# EAGLE design ESP-Gateway (EAGLE 7.5.0)
CNAME: Wemos D1 Mini NRF24 Gateway; CREVISION: 1.0; DESIGNER: Diving91
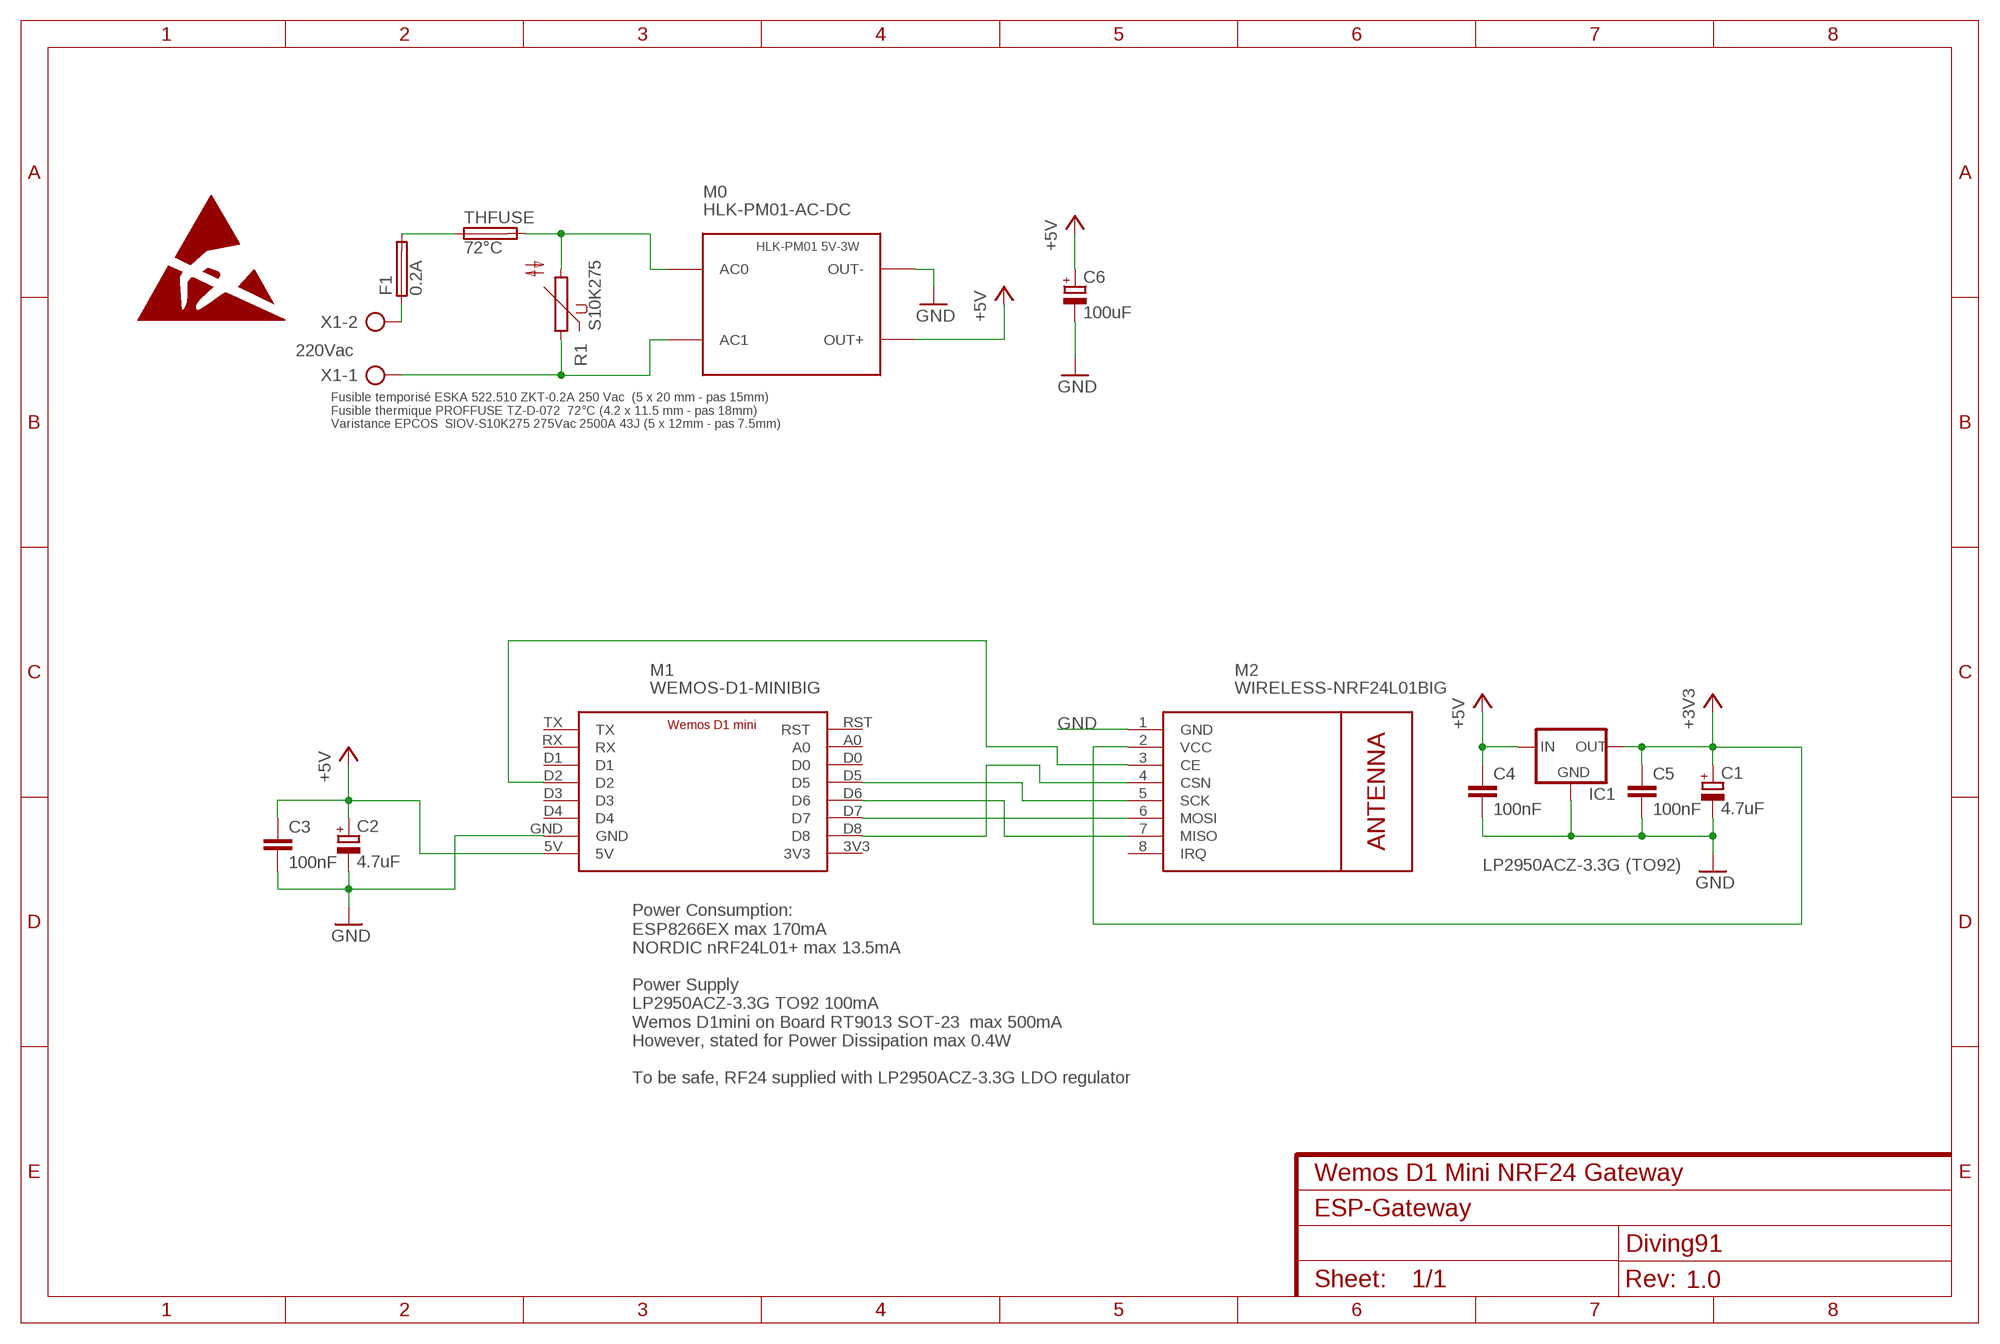
[diagram p0: schematic, sheet 1]

## Parts
C1  4.7uF  CPOL-RAD5X12E2-5  [E2-5@1]
C2  4.7uF  CPOL-RAD5X12E2-5  [E2-5@1]
C3  100nF  C3202.5/4  [C2.5-4]
C4  100nF  C3202.5/4  [C2.5-4]
C5  100nF  C3202.5/4  [C2.5-4]
C6  100uF  CPOL-RADE3-8  [E3-8]
F1  0.2A  PTF75  [PTF75]
IC1  LP2950ACZ-3.3G (TO92)  78LXXTO92L  [DC-DC-TO92L]
M0  HLK-PM01-AC-DC  [HLK-PM01-AC-DC]
M1  WEMOS-D1-MINIBIG  [WEMOS-D1-MINI-DIY]
M2  WIRELESS-NRF24L01BIG  [WIRELESS-NRF24L01-DIY]
R1  S10K275  [S10K275]
THFUSE  72°C  PROFFUSE-TZ-D  [PROFFUSE-TZ-D]
X1  220Vac  DG301-5.0  [DG301-5.0]

## Nets
+3V3 [VCC]: C1.+ C5.1 IC1.OUT M2.2(VCC)
+5V [VCC]: C2.+ C3.1 C4.1 C6.+ IC1.IN M0.OUT+ M1.5V
CE: M1.D2 M2.3(CE)
CSN: M1.D8 M2.4(CSN)
GND [VCC]: C1.- C2.- C3.2 C4.2 C5.2 C6.- IC1.GND M0.OUT- M1.GND M2.1(GND)
MISO: M1.D6 M2.7(MISO)
MOSI: M1.D7 M2.6(MOSI)
N$0 [AC]: M0.AC1 R1.1 X1.1
N$1 [AC]: F1.2 THFUSE.1
N$3 [AC]: F1.1 X1.2
N$4 [AC]: M0.AC0 R1.2 THFUSE.2
SCK: M1.D5 M2.5(SCK)
Unconnected: M1.A0 M1.D0 M1.D1 M1.D3 M1.D4 M1.RST M1.RX M1.TX M2.8(IRQ)

## Notes on the sheet
- Fusible temporisé ESKA 522.510 ZKT-0.2A 250 Vac  (5 x 20 mm - pas 15mm)
  Fusible thermique PROFFUSE TZ-D-072  72°C (4.2 x 11.5 mm - pas 18mm)
  Varistance EPCOS  SIOV-S10K275 275Vac 2500A 43J (5 x 12mm - pas 7.5mm)
- Power Consumption:
  ESP8266EX max 170mA
  NORDIC nRF24L01+ max 13.5mA
  
  Power Supply
  LP2950ACZ-3.3G TO92 100mA
  Wemos D1mini on Board RT9013 SOT-23  max 500mA
  However, stated for Power Dissipation max 0.4W
  
  To be safe, RF24 supplied with LP2950ACZ-3.3G LDO regulator

## Power pins joined to a net without a drawn wire
3V3: M1.3V3

## Library data of the parts
C1 C2 = diving91:CPOL-RAD5X12: POLARIZED CAPACITOR, European symbol
C3-C5 = diving91:C320: CAPACITOR naming: grid - package width
C6 = diving91:CPOL-RAD: POLARIZED CAPACITOR, European symbol
F1 = diving91:PTF75: FUSE HOLDER grid 15mm Stelvio Kontex PTF75
IC1 = diving91:78LXX: VOLTAGE REGULATOR
M0 = diving91:HLK-PM01-AC-DC: HLK-PM01 AC-DC 110-220VAC to 5V Mini Power Supply Module http://www.hlktech.net/product_detail.php?ProId=54
M1 = diving91:WEMOS-D1-MINI: WEMOS D1 mini http://www.wemos.cc/wiki/doku.php?id=en:d1_mini
M2 = diving91:WIRELESS-NRF24L01: 2.4 GHz Wireless Module based on NRF24L01 chip
R1 = diving91:S10K275: VARISTOR
THFUSE = diving91:PROFFUSE-TZ-D: PROFFUSE TZ-D
X1 = diving91:DG301-5.0: CONNECTOR Degson DG301 5.0mm

## Net classes
0 default: width 0.635 mm, clearance 0.635 mm
1 AC: width 1.93 mm, clearance 1.93 mm
2 VCC: width 1.016 mm, clearance 1.143 mm

## Board
Carte Gateway MySensors ESP8266 - RF24 alimentée en 220V
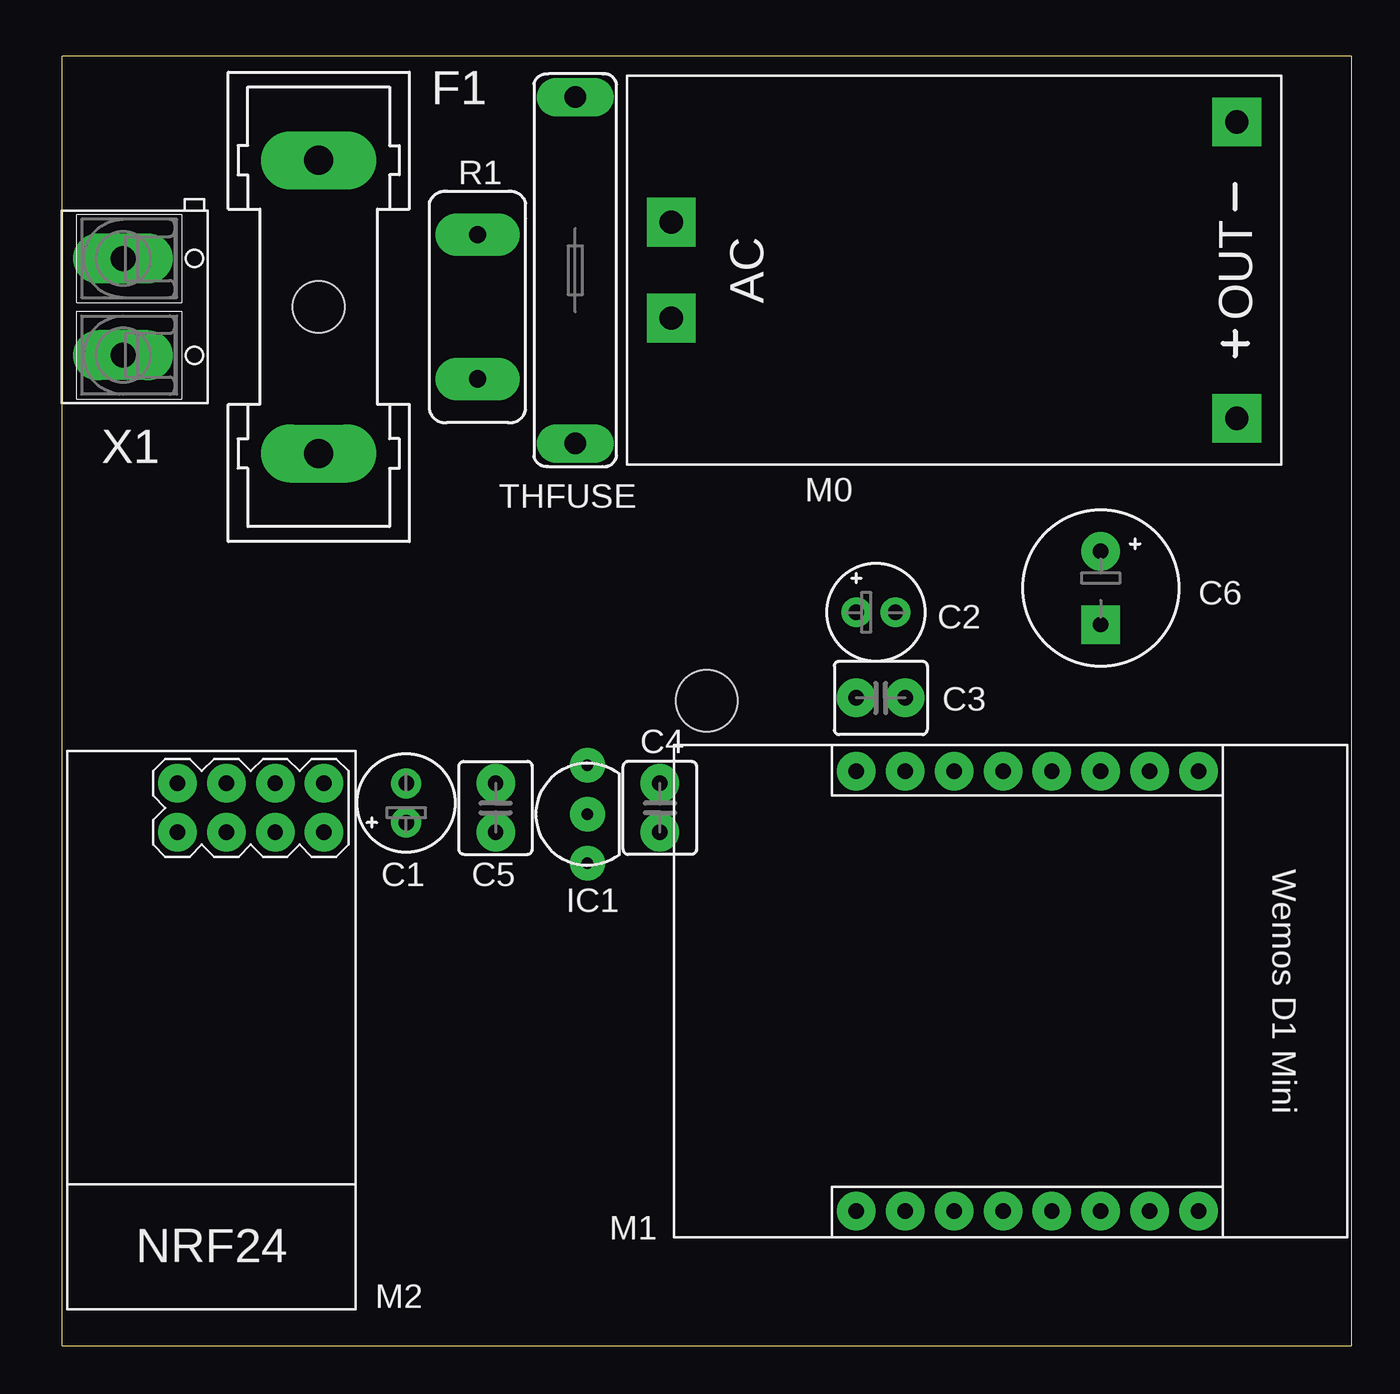
[diagram p1: board, top side]
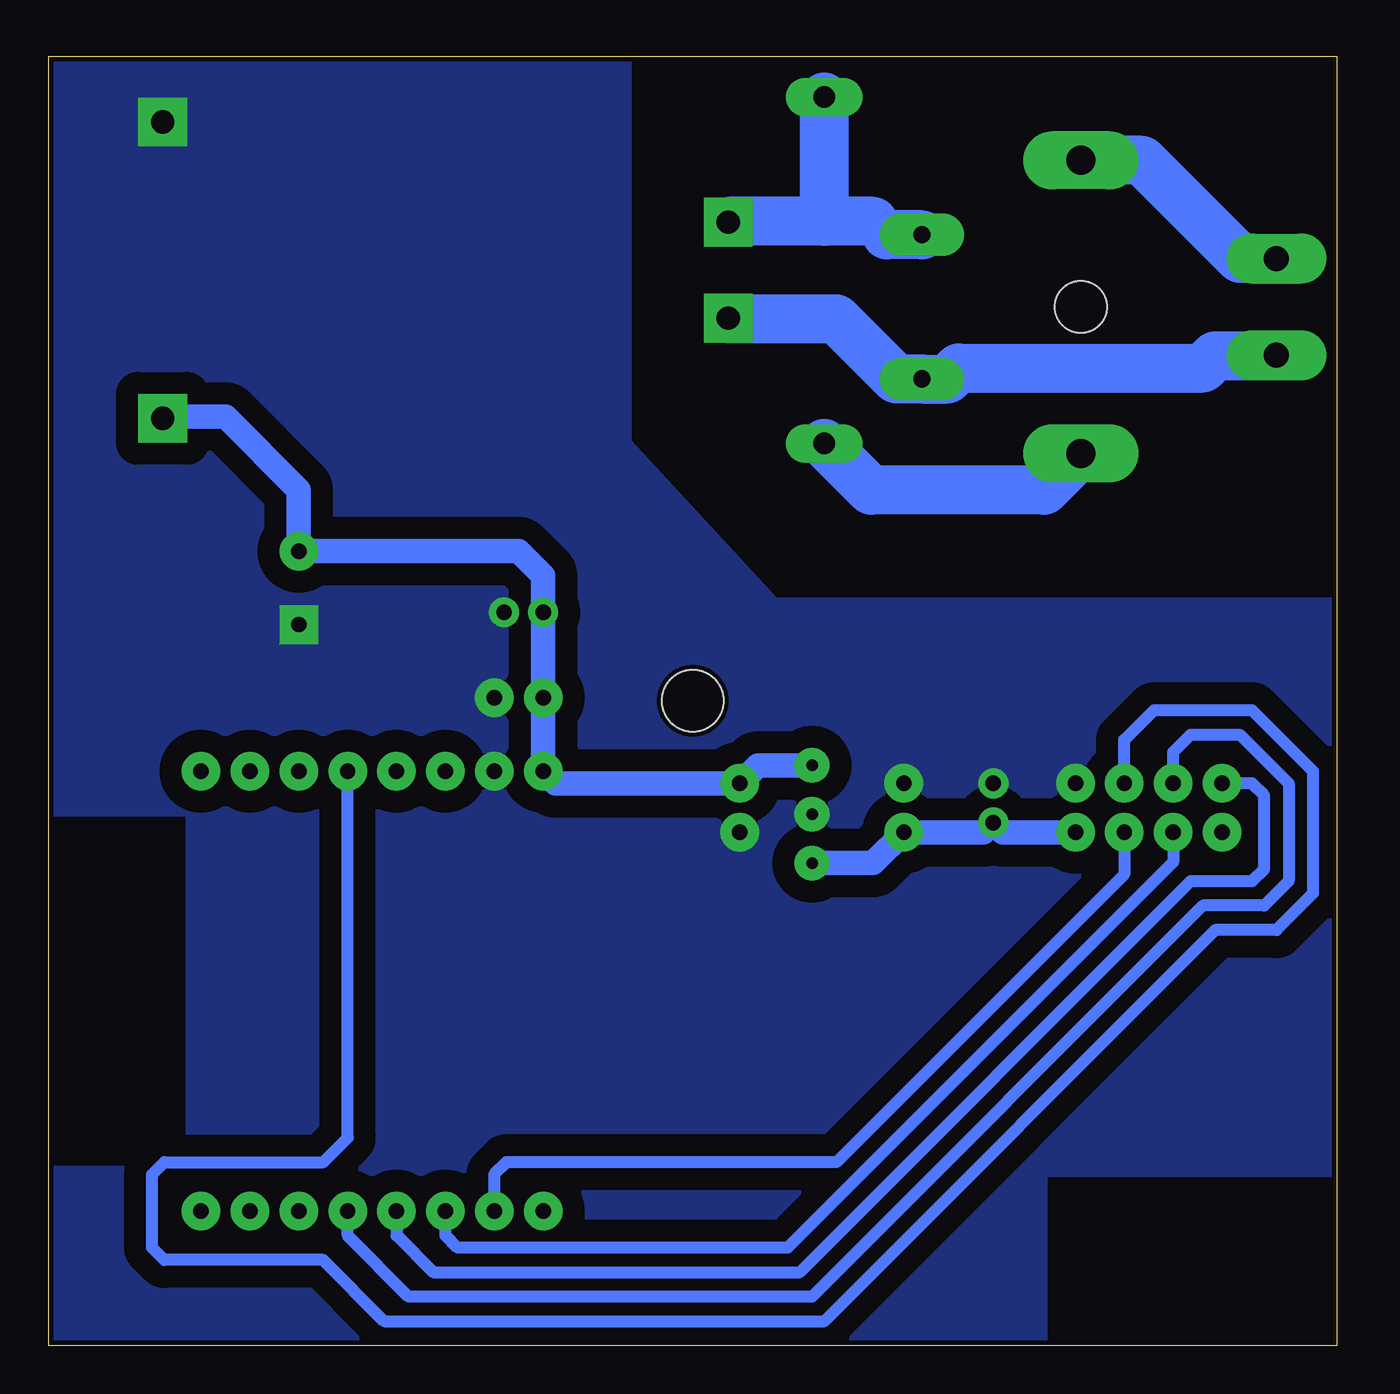
[diagram p2: board, bottom side, seen from below]

Size 67 x 67 mm. Coordinates in mm from the lower left corner, seen from the top.
Outline: 0,0 67,0 67,67 0,67 0,0
Copper layers 16: Bottom 0.035mm
Design rules "DIY *": minimum track width 0.6mm, minimum drill 0.6mm, track to track 0.6mm, track to pad 0.6mm, pad to pad 0.6mm, via to via 0.6mm, smd to smd 0mil, copper to edge 10mil, drill to drill 0.6mm, minimum pad ring 10mil, minimum via ring 6mil, stop-mask expansion 2mil, vias tented up to drill 100mil, thermal gap 0mil
Holes 3.2 mm at 33.5,33.5

### Footprints (pad centres in the part's own frame; a part is rotated, then mirrored left to right if it is on the bottom)
E2-5@1 = drill 0.8 pad 1.55: + -1.016,0; - 1.016,0
C2.5-4 = drill 0.8 pad 2: 1 -1.27,0; 2 1.27,0
E3-8 = drill 0.8 pad 2: + -1.905,0 | drill 0.8 pad 2 square: - 1.905,0
PTF75 = drill 1.5 pad 3 long: 1 -7.62,0; 2 7.62,0 | hole 2.7: 0,0
DC-DC-TO92L = drill 0.6 pad 1.8: GND 0,0; IN 2.54,0; OUT -2.54,0
HLK-PM01-AC-DC = drill 1.2 pad 2.54 square: AC0 -14.7,2.5; AC1 -14.7,-2.5; OUT+ 14.7,-7.7; OUT- 14.7,7.7
WEMOS-D1-MINI-DIY = drill 0.8 pad 2: 3V3 -7.62,-11.43; 5V -7.62,11.43; A0 7.62,-11.43; D0 5.08,-11.43; D1 5.08,11.43; D2 2.54,11.43; D3 0,11.43; D4 -2.54,11.43; D5 2.54,-11.43; D6 0,-11.43; D7 -2.54,-11.43; D8 -5.08,-11.43; GND -5.08,11.43; RST 10.16,-11.43; RX 7.62,11.43; TX 10.16,11.43
WIRELESS-NRF24L01-DIY = drill 0.8 pad 2: 1 -12.7,6.35; 2 -10.16,6.35; 3 -12.7,3.81; 4 -10.16,3.81; 5 -12.7,1.27; 6 -10.16,1.27; 7 -12.7,-1.27; 8 -10.16,-1.27
S10K275 = drill 0.9 pad 2.2 long: 1 0,-3.75; 2 0,3.75
PROFFUSE-TZ-D = drill 1.1 pad 2 long: 1 -9,0; 2 9,0
DG301-5.0 = drill 1.3 pad 2.6 long: 1 -2.515,0; 2 2.515,0

### Placement (x,y rotation side)
C1  17.88,28.19 90 top
C2  42.29,38.1 0 top
C3  42.55,33.66 0 top
C4  31.06,27.94 270 top
C5  22.53,27.94 90 top
C6  53.98,39.37 270 top
DRILEGEND  [DRILEGEND]  -9.93,-3.96 0 top  (outside the outline)
F1  13.34,53.98 270 top
IC1  27.3,27.61 90 top
M0  46.35,55.88 0 top
M1  48.9,18.41 0 top
M2  7.26,16.51 270 top
R1  21.59,53.98 0 top
THFUSE  26.67,55.88 90 top
X1  3.17,53.98 90 top

### Tracks (layer width: path | path; a pad name or v marks a point on that pad's centre or on a via)
+3V3
  Bottom 1.27: M2.2 17.37,26.67 C1.+ 18.39,26.67 C5.1 24.13,25.07 IC1.OUT
+5V
  Bottom 1.27: IC1.IN 30.12,30.15 C4.1 40.64,29.21 M1.5V C3.1 C2.+ 41.27,40.01 42.55,41.27 C6.+ 53.98,44.45 57.78,48.26 60.98,48.26 M0.OUT+
CE
  Bottom 0.635: M2.3 11.07,31.47 9.53,33.02 4.45,33.02 1.27,29.84 1.27,23.5 3.17,21.59 6.35,21.59 26.67,1.27 49.53,1.27 52.7,4.45 60.96,4.45 61.59,5.08 61.59,8.89 60.96,9.53 52.7,9.53 51.44,10.79 M1.D2
CSN
  Bottom 0.635: M2.4 11.07,24.49 26.04,9.53 43.18,9.53 43.81,8.89 M1.D8
GND
  pour Bottom: 0,8.89 15.24,8.89 15.24,0 66.98,0 66.98,9.19 59.69,9.19 59.69,27.64 66.98,27.64 66.98,67.31 36.83,67.31 36.83,46.99 29.21,38.73 0,38.73
MISO
  Bottom 0.635: M1.D6 48.9,5.71 46.99,3.81 27.94,3.81 7.62,24.13 4.45,24.13 3.81,24.77 3.81,28.57 4.45,29.21 M2.7
MOSI
  Bottom 0.635: M2.6 8.53,25.12 28.57,5.08 45.72,5.08 46.35,5.71 M1.D7
N$0
  Bottom 1.93: 31.61,53.34 M0.AC1 | 3.2,51.44 X1.1
  Bottom 2.54: 31.61,53.34 26.04,53.34 22.92,50.23 R1.1 20.26,50.23 19.68,50.8 6.99,50.8 6.35,51.44 3.2,51.44
N$1
  Bottom 2.54: F1.2 15.24,44.45 24.24,44.45 THFUSE.1
N$3
  Bottom 2.54: X1.2 5.05,56.49 10.16,61.59 F1.1
N$4
  Bottom 1.93: 23.43,57.73 24.13,58.42 | 31.61,58.42 M0.AC0
  Bottom 2.54: R1.2 23.43,57.73 | 26.67,58.42 31.61,58.42 | 24.13,58.42 26.67,58.42 | 26.67,58.42 THFUSE.2
SCK
  Bottom 0.635: M2.5 8.53,30.84 7.62,31.75 5.08,31.75 2.54,29.21 2.54,24.13 3.81,22.86 6.99,22.86 27.3,2.54 48.26,2.54 51.44,5.71 M1.D5

### Text on the board
DrillLegend: LAYER-STACK
DrillLegend_01-16: 01-16
DrillLegend_01-20: 01-20